# EAGLE design Adafruit MPR121 Breakout (EAGLE 6.4)
COMPANY: ADAFRUIT INDUSTRIES; DRAWN: KTOWN; REV: A
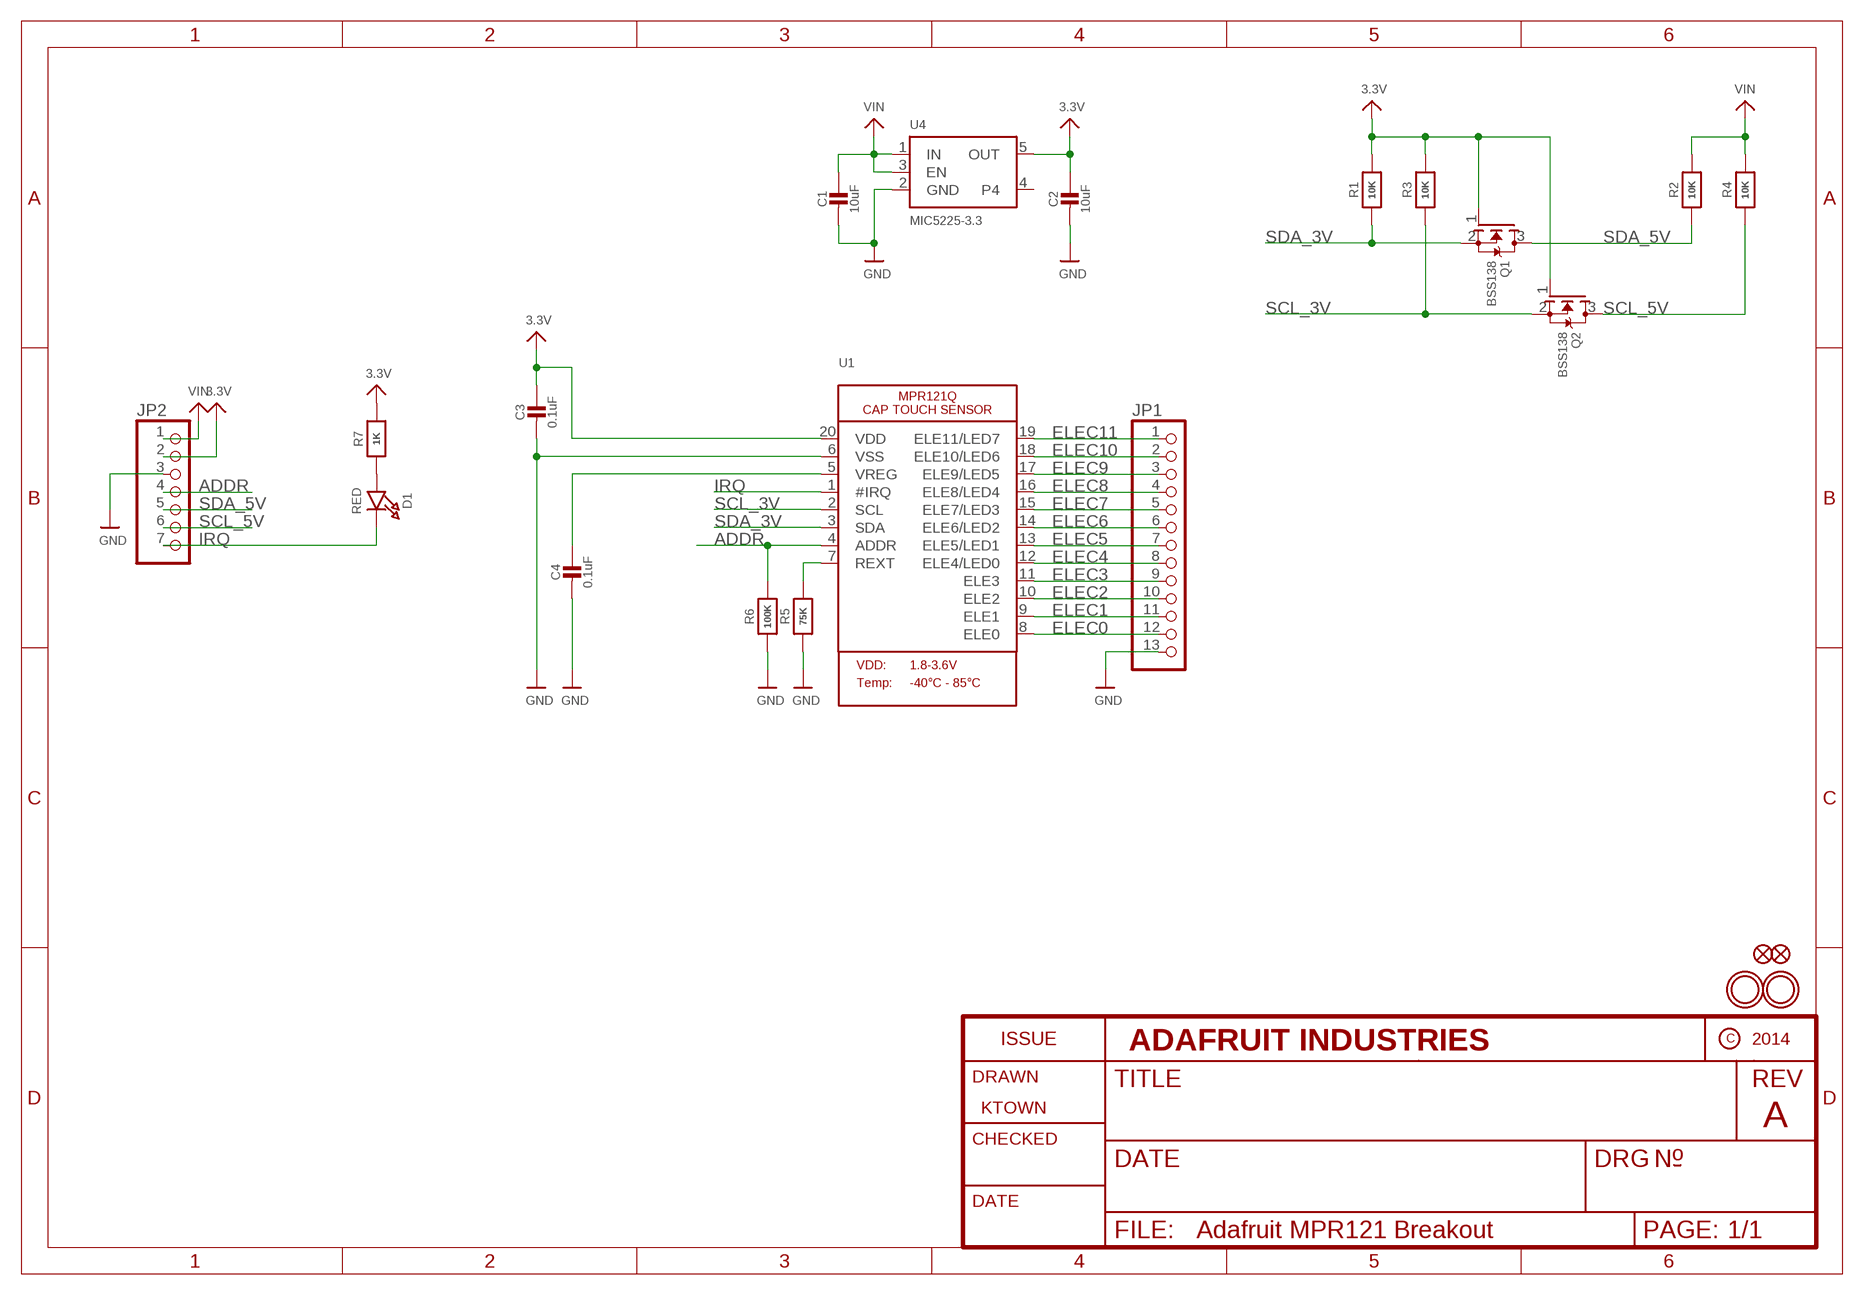
[diagram p0: schematic, sheet 1]

## Parts
C1  10uF  CAP_CERAMIC0805-NOOUTLINE  [0805-NO]
C2  10uF  CAP_CERAMIC0805-NOOUTLINE  [0805-NO]
C3  0.1uF  CAP_CERAMIC0805_10MGAP  [0805_10MGAP]
C4  0.1uF  CAP_CERAMIC0805-NOOUTLINE  [0805-NO]
D1  RED  LED0805_NOOUTLINE  [CHIPLED_0805_NOOUTLINE]
FID1  FIDUCIAL""  [FIDUCIAL_1MM]
FID2  FIDUCIAL""  [FIDUCIAL_1MM]
JP1  HEADER-1X13  [1X13_ROUND_70]
JP2  HEADER-1X770MIL  [1X07_ROUND_70]
Q1  BSS138  MOSFET-NWIDE  [SOT23-WIDE]
Q2  BSS138  MOSFET-NWIDE  [SOT23-WIDE]
R1  10K  RESISTOR0805_NOOUTLINE  [0805-NO]
R2  10K  RESISTOR0805_NOOUTLINE  [0805-NO]
R3  10K  RESISTOR0805_NOOUTLINE  [0805-NO]
R4  10K  RESISTOR0805_NOOUTLINE  [0805-NO]
R5  75K  RESISTOR0805_NOOUTLINE  [0805-NO]
R6  100K  RESISTOR0805_NOOUTLINE  [0805-NO]
R7  1K  RESISTOR0805_NOOUTLINE  [0805-NO]
U1  MPR121Q  [QFN20_3MM_NOTHERMAL]
U4  MIC5225-3.3  VREG_SOT23-5  [SOT23-5]
U$10  MOUNTINGHOLE2.5  [MOUNTINGHOLE_2.5_PLATED]
U$11  MOUNTINGHOLE2.5  [MOUNTINGHOLE_2.5_PLATED]

## Nets
3.3V: C2.1 C3.1 JP2.2 Q1.1(G) Q2.1(G) R1.2 R3.2 R7.2 U1.20(VDD) U4.5(OUT)
ADDR: JP2.4 R6.2 U1.4(ADDR)
ELEC0: JP1.12 U1.8(ELE0)
ELEC1: JP1.11 U1.9(ELE1)
ELEC2: JP1.10 U1.10(ELE2)
ELEC3: JP1.9 U1.11(ELE3)
ELEC4: JP1.8 U1.12(ELE4/LED0)
ELEC5: JP1.7 U1.13(ELE5/LED1)
ELEC6: JP1.6 U1.14(ELE6/LED2)
ELEC7: JP1.5 U1.15(ELE7/LED3)
ELEC8: JP1.4 U1.16(ELE8/LED4)
ELEC9: JP1.3 U1.17(ELE9/LED5)
ELEC10: JP1.2 U1.18(ELE10/LED6)
ELEC11: JP1.1 U1.19(ELE11/LED7)
GND: C1.2 C2.2 C3.2 C4.2 JP1.13 JP2.3 R5.1 R6.1 U1.6(VSS) U4.2(GND)
IRQ: D1.C JP2.7 U1.1(#IRQ)
N$1: D1.A R7.1
N$2: C4.1 U1.5(VREG)
N$3: R5.2 U1.7(REXT)
SCL_3V: Q2.2(S) R3.1 U1.2(SCL)
SCL_5V: JP2.6 Q2.3(D) R4.1
SDA_3V: Q1.2(S) R1.1 U1.3(SDA)
SDA_5V: JP2.5 Q1.3(D) R2.1
VIN: C1.1 JP2.1 R2.2 R4.2 U4.1(IN) U4.3(EN)
Unconnected: U4.4

## Library data of the parts
C1-C4 = microbuilder:CAP_CERAMIC: Ceramic Capacitors For new designs, use the packages preceded by an '_' character since they are more reliable: The following footprints should be used on most boards: _0402 - Standard footprint for regular board layouts _0603 - Standard footprint for regular board layouts _0805 - Standard footprint for regular board layouts _1206 - Standard footprint for regular board layouts For extremely tight-pitch boards where space is at a premium, the following 'micro-pitch' footprints can be used (smaller pads, no silkscreen outline, etc.): _0402MP - Micro-pitch footprint for very dense/compact boards _0603MP - Micro-pitch footprint for very dense/compact boards _0805MP - Micro-pitch footprint for very dense/compact boards _1206MP - Micro-pitch footprint for very dense/compact boards
D1 = microbuilder:LED: LED 0603 - 0603 Surface Mount Package 2mA: Green LED - Low Power (3.9mcd, 2ma, 1.7Vf) - Digikey: 475-2709-2-ND Orange LED - Low Power (9.8mcd, 2ma, 1.8Vf) - Digikey: 475-1194-2-ND Red LED - Low Power (5mcd, 2ma, 1.8Vf) - Digikey: 475-1195-2-ND Yellow LED - Low Power (7mcd, 2ma, 1.8Vf) - Digikey: 475-1196-2-ND 5mA: Blue LED - Low Power (17mcd, 5ma, 2.9Vf) - Digikey: LNJ937W8CRACT-ND 0805 - 0805 Surface Mount Package 2mA: Red LED (8.8mcd, 2mA, 1.8Vf, Clear) - Low Power [Digikey: 475-2510-1-ND] Green LED (5mcd, 2mA, 1.8Vf, Clear) - Low Power [Digikey: 475-2730-1-ND] Yellow LED (11.3mcd, 2mA, 1.8Vf, Clear) - Low Power [Digikey: 475-2555-1-ND] 20mA: Red LED (104mcd, 20mA, Diffused) - LS R976 [Digikey: 475-1278-6-ND] Red LED (12mcd, 20mA, 2.0Vf, Clear) - APT2012EC [Digikey: 754-1128-1-ND] Green LED (15mcd, 20mA, 2.2Vf, Clear) - APT2012GC [Digikey: 754-1131-1-ND] Orange LED (160mcd, 20mA, 2.1Vf, Clear) - APT2012SECK [Digikey: 754-1130-1-ND] 1206 - 1206 Surface Mount Package Green LED (26mcd, 20mA, Diffused) - LG N971 [Digikey: 475-1407-6-ND] Red LED (15mcd, 20mA, Diffused) - LH N974 [Digikey: 475-1416-6-ND] Cree - Cree High-Power Surface Mount LEDs XPEBWT-L1-0000-00D50 - White 111lm 350mA 2.9Vf 6200K 110° XTEAWT-00-0000-00000LEE3 - White 114lm 350mA 2.85Vf 5000K 115° Everlight - Everlight 45-21 Series Surface Mount LEDs 45-21/QK2C-B2832AC2CB2/2T - Warm White 2000mcd 20mA 3.25Vf 3050K 120° 45-21/LK2C-B38452C4CB2/2T - Nuetral White 2000mcd 20mA 3.25Vf 4150K 120° 45-21/LK2C-B50634C6CB2/2T - Cold White 2200mcd 20mA 3.25Vf 5650K 120° PLCC2 Reverse Mount LS T77K-J1L2-1-0-2-R18-Z - Red 11.25mcd 2mA 1.8Vf 630nm 120° LO T77K-L1M2-24-Z - Orange 19.6mcd 2mA 1.8Vf 606nm 120° LY T77K-K2M1-26-Z - Yellow 15.7mcd 2mA 1.8Vf 587nm 120°
FID1 FID2 = microbuilder:FIDUCIAL: Fiducial Alignment Points Various fiducial points for machine vision alignment.; BOM: EXCLUDE
JP1 = microbuilder:HEADER-1X13
JP2 = microbuilder:HEADER-1X7: PIN HEADER
Q1 Q2 = microbuilder:MOSFET-N: N-Channel Mosfet LEGEND VDS: Voltage Drain-Source ID: Drain Current RDS(ON): Drain-Source On-State Resistance VGS(TH): Gate-Source Threshold Voltage CISS: Drain-Source Input Capacitance SOT-23 Name VDS ID RDS(ON) VGS(TH) CISS Order Number 2N7002E 60V 260mA 2.5 Ohm 2.5V @ 250uA 26.7pF @ 25V 2N7002ET1GOSTR-ND BSH103 30V 850mA 400 mOhm 400mV @ 1mA 83pF @ 24V BSH103,235-ND BSS138 60V 320mA 1.6 Ohm 1.5V @ 250uA 50pF @ 10V Mouser: 771-BSS138PW115 DMN2075U-7 20V 4.2A 38 mOhm 1V @ 250 uA 594.3pF @ 10V DMN2075U-7DICT-ND * BSS138 good choice for I2C level-shifting POWERPAK 1212-8 Name VDS ID RDS(ON) VGS(TH) CISS Order Number Si7308DN 60V 6A 58 mOhm 3V @ 250uA 665pF @ 15V SI7308DN-T1-E3CT-ND
R1-R7 = microbuilder:RESISTOR: Resistors For new designs, use the packages preceded by an '_' character since they are more reliable: The following footprints should be used on most boards: _0402 - Standard footprint for regular board layouts _0603 - Standard footprint for regular board layouts _0805 - Standard footprint for regular board layouts _1206 - Standard footprint for regular board layouts For extremely tight-pitch boards where space is at a premium, the following 'micro-pitch' footprints can be used (smaller pads, no silkscreen outline, etc.): _0402MP - Micro-pitch footprint for very dense/compact boards _0603MP - Micro-pitch footprint for very dense/compact boards _0805MP - Micro-pitch footprint for very dense/compact boards _1206MP - Micro-pitch footprint for very dense/compact boards
U1 = microbuilder:MPR121Q: MPR121Q - 12 Electrode Cap Touch Sensor Can drive up to 8 LEDs
U4 = microbuilder:VREG_SOT23-5: SOT23-5 Fixed Voltage Regulators Part Current Out V Out V In V Dropout θJA (°C/W) TJ (°C) Digikey Part No. ADP121 150mA 3.3V 3.4-5.5V 0.09V @ 150mA -- -- ADP121-AUJZ33R7CT-ND ADP121 150mA 3.0V 3.1-5.5V 0.09V @ 150mA -- -- ADP121-AUJZ30R7CT-ND ADP122 300mA 3.3V 3.4-5.5V 0.085V @ 300mA -- -- ADP122AUJZ-3.3-R7CT-ND ADP1712 300mA 3.3V 3.5-5.5V 0.17V @ 300mA -- -- ADP1712AUJZ-3.3-R7TR-ND AP7311 (Low Cost) 150mA 3.3V 3.5-6V 0.15V @ 150mA -- -- AP7311-33WG-7DICT-ND LD39015M18R 150mA 1.8V 1.9V-5.5V 0.08V @ 100mA -- -- 497-6977-1-ND LP2985A-33DBVR 150mA 3.3V 3.3-16V 0.28V @ 150mA 206 150 296-18479-1-ND MCP1824T-3302E/OT 300mA 3.3V 3.5V-6V 0.2V @ 300mA -- -- MCP1824T-3302E/OTCT-ND MIC5205-2.5YM5 TR 150mA 2.5V 2.7-16V 0.165V @ 150mA -- -- 576-1257-2-ND MIC5205-3.0YM5 TR 150mA 3.0V 3.2V-16V 0.165V @ 150mA -- -- 576-1258-2-ND MIC5205-3.3YM5 TR 150mA 3.3V 3.5V-16V 0.165V @ 150mA -- -- 576-1259-2-ND TPS780330220 150mA 3.3V+2.2V 3.6-5.5V 250mV Max -- -- 296-23332-1-ND TDA3663/N1,135 100mA 3.3V 3.5-45V 0.18V @ 50mA -- -- 568-5343-1-ND Max operating temp can be calculated using θJA, TJ (max junction temperature), and power in watts. Set the "Maximum Ambient Temperature" until it reaches TJ ("Max Junction Temperature"), which is the absolute limit for safe use of the regulator: Heat Sink Temperature Calculator <http://www.daycounter.com/Calculators/Heat-Sink-Temperature-Calculator.phtml> For example, With 12V source into a 3.3V LP2985 and a 30mA load, we are dissipating (12V-3.3V) * 0.03A = 0.261W. With a θJA of 206 °C/W, a TJ of 150°C, and 261mW we can safely use the chip without a heat sink up to 75°C (=147.1°C Junction Temperature).
U$10 U$11 = microbuilder:MOUNTINGHOLE: Mounting Hole For #2 screws (0.086"/2.18mm width, 0.094"/2.4mm hole) use 2.5mm; BOM: EXCLUDE

## Board
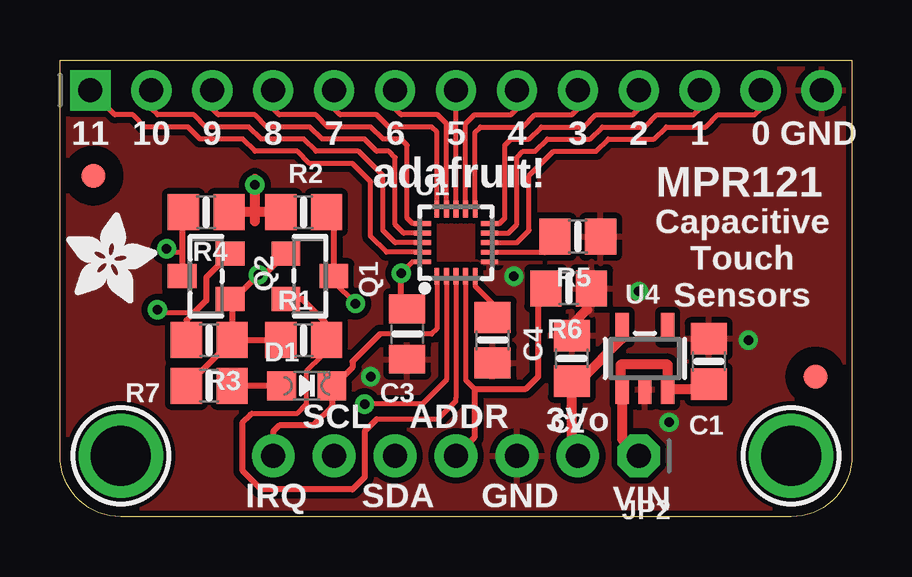
[diagram p1: board, top side]
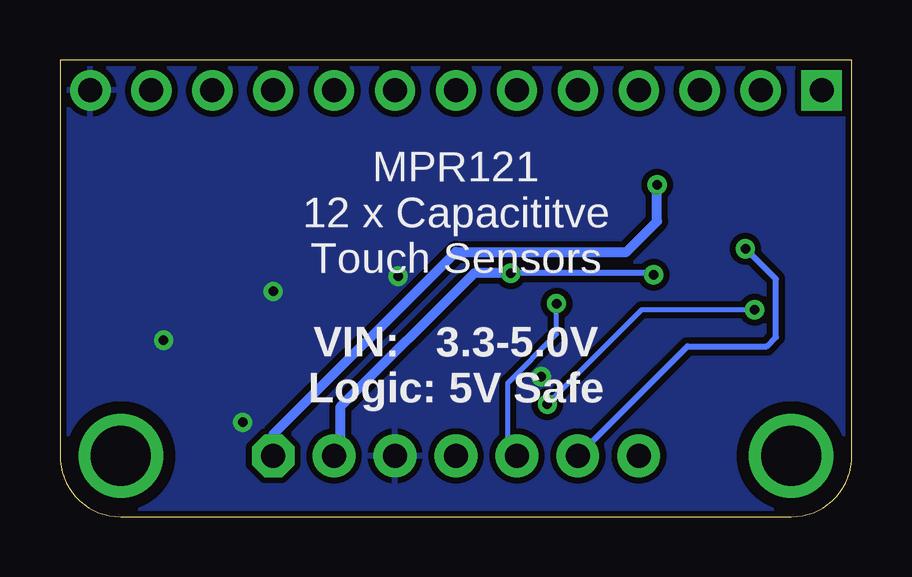
[diagram p2: board, bottom side, seen from below]

Size 33.02 x 19.05 mm. Coordinates in mm from the lower left corner, seen from the top.
Outline: 33.02,19.05 33.02,2.54 arc-90 30.48,0 2.54,0 arc-90 0,2.54 0,19.05 33.02,19.05
Copper layers (1*16): Top 0.035mm / dielectric 1.5mm / Bottom 0.035mm
Design rules "adafruit *": minimum track width 7mil, minimum drill 15.5mil, track to track 6mil, track to pad 6mil, pad to pad 6mil, via to via 6mil, smd to smd 6mil, copper to edge 10mil, drill to drill 8mil, minimum pad ring 10mil, minimum via ring 8mil, stop-mask expansion 2mil, vias tented up to drill 20mil, thermal gap 10mil

### Footprints (pad centres in the part's own frame; a part is rotated, then mirrored left to right if it is on the bottom)
0805-NO = smd 1.3 x 1.5: 1 -0.95,0; 2 0.95,0
0805_10MGAP = smd 1.2 x 1.5: 1 -1.05,0; 2 1.05,0
CHIPLED_0805_NOOUTLINE = smd 1.2 x 1.2: A 0,-1.05; C 0,1.05
FIDUCIAL_1MM = smd 1 x 1: 1 0,0
1X13_ROUND_70 = drill 1 pad 1.676 square: 1 -15.24,0 | drill 1 pad 1.676: 2 -12.7,0; 3 -10.16,0; 4 -7.62,0; 5 -5.08,0; 6 -2.54,0; 7 0,0; 8 2.54,0; 9 5.08,0; 10 7.62,0; 11 10.16,0; 12 12.7,0; 13 15.24,0
1X07_ROUND_70 = drill 1 pad 1.778 octagon: 1 -7.62,0 | drill 1 pad 1.778: 2 -5.08,0; 3 -2.54,0; 4 0,0; 5 2.54,0; 6 5.08,0; 7 7.62,0
SOT23-WIDE = smd 1 x 1.2: 1 -0.95,-1; 2 0.95,-1; 3 0,1
QFN20_3MM_NOTHERMAL = smd 0.7 x 0.2: 1 -1.4,0.8; 2 -1.4,0.4; 3 -1.4,0; 4 -1.4,-0.4; 5 -1.4,-0.8; 11 1.4,-0.8; 12 1.4,-0.4; 13 1.4,0; 14 1.4,0.4; 15 1.4,0.8 | smd 0.2 x 0.7: 6 -0.8,-1.4; 7 -0.4,-1.4; 8 0,-1.4; 9 0.4,-1.4; 10 0.8,-1.4; 16 0.8,1.4; 17 0.4,1.4; 18 0,1.4; 19 -0.4,1.4; 20 -0.8,1.4
SOT23-5 = smd 0.55 x 1.2: 1 -0.95,-1.3; 2 0,-1.3; 3 0.95,-1.3; 4 0.95,1.3; 5 -0.95,1.3
MOUNTINGHOLE_2.5_PLATED = drill 2.5 pad 3.2: P$1 0,0

### Placement (x,y rotation side)
C1  27.05,6.48 90 top
C2  21.34,6.6 90 top
C3  14.48,7.62 270 top
C4  18.03,7.37 270 top
D1  10.29,5.46 270 top
FID1  31.5,5.84 180 top
FID2  1.4,14.22 180 top
JP1  16.51,17.78 0 top
JP2  16.51,2.54 180 top
Q1  10.41,10.03 270 top
Q2  6.1,10.03 90 top
R1  10.16,7.37 180 top
R2  10.16,12.7 180 top
R3  6.22,7.37 0 top
R4  6.1,12.7 0 top
R5  21.59,11.68 180 top
R6  21.21,9.53 180 top
R7  6.22,5.46 180 top
U1  16.51,11.43 90 top
U4  24.38,6.6 0 top
U$10  2.54,2.54 180 top
U$11  30.48,2.54 180 top
U$14  [ADAFRUIT_3.5MM]  0.25,8.89 0 top

### Tracks (layer width: path | path; a pad name or v marks a point on that pad's centre or on a via)
3.3V  (via drill 0.39, 0.4)
  Top 0.203: U1.20 14.69,10.63 v14.22,10.16
  Top 0.254: R3.2 7.17,9.16 Q2.1 7.26,9.08 v8.27,10.09 8.53,10.09 Q1.1 | R7.2 R3.2 | R3.2 R1.2 | v14.22,10.16 14.22,8.89 14.48,8.64 C3.1
  Top 0.406: U4.5 23.43,7.43 21.66,5.65 C2.1 21.34,2.79 JP2.2
  Bottom 0.254: v8.27,10.09 8.34,10.16 v14.22,10.16
  Bottom 0.406: v14.22,10.16 15.75,10.16 21.34,4.57 21.34,2.79 JP2.2
ADDR
  Top 0.203: U1.4 16.91,5.7 17.27,5.33
  Top 0.254: 19.94,9.33 19.94,5.84 19.43,5.33 17.27,5.33 17.27,3.3 JP2.4
  Top 0.406: 19.94,9.33 20.13,9.53 R6.2
ELEC0
  Top 0.203: U1.8 19.05,11.43 19.56,11.94 19.56,14.22 20.57,15.24 22.35,15.24 22.86,15.75 24.77,15.75 25.27,16.26 26.92,16.26 27.43,16.76 28.96,16.76 29.21,17.02 JP1.12
ELEC1
  Top 0.203: U1.9 18.69,11.83 19.05,12.19 19.05,14.99 19.3,15.24 19.81,15.24 20.32,15.75 22.1,15.75 22.61,16.26 24.38,16.26 24.89,16.76 26.42,16.76 26.67,17.02 JP1.11
ELEC2
  Top 0.203: U1.10 18.33,12.23 18.54,12.45 18.54,15.49 18.8,15.75 19.56,15.75 20.07,16.26 21.84,16.26 22.35,16.76 23.88,16.76 24.13,17.02 JP1.10
ELEC3
  Top 0.203: U1.11 17.31,16.04 17.53,16.26 19.3,16.26 19.81,16.76 21.34,16.76 21.59,17.02 JP1.9
ELEC4
  Top 0.203: U1.12 16.91,16.4 17.27,16.76 18.8,16.76 19.05,17.02 JP1.8
ELEC5
  Top 0.203: U1.13 JP1.7
ELEC6
  Top 0.203: U1.14 16.11,16.4 15.75,16.76 14.22,16.76 13.97,17.02 JP1.6
ELEC7
  Top 0.203: U1.15 15.71,16.04 15.49,16.26 13.72,16.26 13.21,16.76 11.68,16.76 11.43,17.02 JP1.5
ELEC8
  Top 0.203: U1.16 14.69,12.23 14.48,12.45 14.48,15.49 14.22,15.75 13.46,15.75 12.95,16.26 11.18,16.26 10.67,16.76 9.14,16.76 8.89,17.02 JP1.4
ELEC9
  Top 0.203: U1.17 14.33,11.83 13.97,12.19 13.97,14.99 13.72,15.24 13.21,15.24 12.7,15.75 10.92,15.75 10.41,16.26 8.64,16.26 8.13,16.76 6.6,16.76 6.35,17.02 JP1.3
ELEC10
  Top 0.203: U1.18 13.97,11.43 13.46,11.94 13.46,14.22 12.45,15.24 10.67,15.24 10.16,15.75 8.38,15.75 7.87,16.26 6.1,16.26 5.59,16.76 4.06,16.76 3.81,17.02 JP1.2
ELEC11
  Top 0.203: U1.19 13.61,11.03 12.95,11.68 12.95,13.97 12.19,14.73 10.41,14.73 9.91,15.24 8.13,15.24 7.62,15.75 5.84,15.75 5.33,16.26 3.56,16.26 3.05,16.76 2.29,16.76 JP1.1
GND  (via drill 0.39)
  Top 0.406: C2.2 21.34,8 21.97,8.64 21.97,9.33 R6.1
  other vias: 18.92,10.03 28.7,7.37 25.4,3.94 24.13,9.4 12.95,5.84
  pour Top (isolate 0.254): 33.02,0 0,0 0,19.05 33.02,19.05
  pour Bottom (isolate 0.254): 33.02,0 0,0 0,19.05 33.02,19.05
IRQ
  Top 0.203: U1.1 15.71,7.84 15.49,7.62 13.34,7.62
  Top 0.254: 13.34,7.62 12.19,6.48 12.19,6.22 11.43,5.46 D1.C 11.34,4.61 10.54,3.81 9.14,3.81 8.89,3.56 JP2.7
N$1
  Top 0.254: D1.A R7.1
N$2
  Top 0.203: U1.5 17.31,9.61 18.03,8.89 C4.1
N$3
  Top 0.203: U1.7 20.21,11.03
  Top 0.254: 20.21,11.03 20.64,11.46 R5.2
SCL_3V  (via drill 0.39)
  Top 0.203: U1.2 16.11,5.7 15.11,4.7 v12.7,4.7 | v4.06,8.64 4.19,8.51 5.59,8.51
  Top 0.254: Q2.2 6.1,9.98 6.1,9.02 5.59,8.51 5.27,8.19 R3.1 5.15,7.24
  Bottom 0.203: v12.7,4.7 8.76,8.64 v4.06,8.64
SCL_5V  (via drill 0.39)
  Top 0.203: v4.45,11.18 4.57,11.05 5.1,11.05
  Top 0.254: R4.1 5.1,12.65 5.1,11.05 Q2.3
  Bottom 0.254: JP2.6 6.86,7.11 3.56,7.11 3.17,7.49 3.17,9.91 v4.45,11.18
SDA_3V
  Top 0.203: U1.3 16.51,4.95 16.51,4.83 15.75,4.06 13.21,4.06 | 7.94,4.25 8,4.32 9.91,4.32 10.29,4.7 10.29,6.1 10.92,6.73 10.92,7.18 R1.1
  Top 0.254: R1.1 11.05,7.43 11.05,8.13 10.09,9.08 Q1.2 | 13.21,4.06 12.7,3.56 12.7,1.65 12.19,1.14 8.38,1.14 7.62,1.91 7.62,3.94 7.94,4.25
SDA_5V  (via drill 0.39)
  Top 0.203: v12.32,8.89 11.41,9.79 Q1.3
  Top 0.254: R2.1 11.41,12.4 Q1.3
  Bottom 0.203: JP2.5 14.35,2.92 14.35,5.59 12.32,7.62 v12.32,8.89
VIN  (via drill 0.39)
  Top 0.406: C1.1 26.83,5.3 U4.3 | R2.2 8.13,12.7 | 8.13,12.7 R4.2 | 8.13,12.7 v8.13,13.84 8.13,14.1 | U4.3 25.33,6.35 23.37,6.35 23.37,5.3 U4.1 23.43,3.24 JP2.1 | U4.3 25.4,5.24 | 8.13,12.32 8.13,12.7
  Bottom 0.406: JP2.1 24.13,3.43 16.51,11.05 9.4,11.05 8.13,12.32 v8.13,13.84

### Text on the board
tPlace: 11 | 10 | 9 | 8 | 7 | 6 | 5 | 4 | 3 | 2 | 1 | 0 | GND | adafruit! | MPR121 | Capacitive / Touch / Sensors | SCL | ADDR | 3Vo | IRQ | SDA | GND | VIN
bPlace: MPR121 / 12 x Capacititve / Touch Sensors | VIN: 3.3-5.0V / Logic: 5V Safe